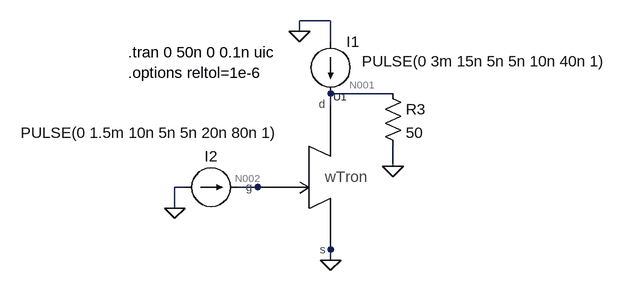
[diagram p0: schematic wtron_test.asc]
wtron_test.asc, the LTspice schematic file:
Version 4
SHEET 1 880 680
WIRE 288 112 240 112
WIRE 240 128 240 112
WIRE 288 144 288 112
WIRE 384 224 288 224
WIRE 288 240 288 224
WIRE 384 336 384 304
WIRE 64 368 48 368
WIRE 176 368 144 368
WIRE 192 368 176 368
WIRE 48 400 48 368
WIRE 288 464 288 448
WIRE 288 480 288 464
FLAG 240 128 0
FLAG 384 336 0
FLAG 48 400 0
FLAG 288 480 0
SYMBOL wtron 288 352 R0
SYMATTR InstName U1
SYMATTR Value2 ""
SYMATTR Value ""
SYMATTR SpiceLine ""
SYMBOL res 368 208 R0
SYMATTR InstName R3
SYMATTR Value 50
SYMBOL current 288 144 R0
WINDOW 123 0 0 Left 0
WINDOW 39 0 0 Left 0
WINDOW 3 48 30 Left 2
SYMATTR Value PULSE(0 3m 15n 5n 5n 10n 40n 1)
SYMATTR InstName I1
SYMBOL current 64 368 R270
WINDOW 0 32 40 VTop 2
WINDOW 3 99 -54 VBottom 2
WINDOW 123 0 0 Left 0
WINDOW 39 0 0 Left 0
SYMATTR InstName I2
SYMATTR Value PULSE(0 1.5m 10n 5n 5n 20n 80n 1)
TEXT -24 160 Left 2 !.tran 0 50n 0 0.1n uic
TEXT -24 192 Left 2 !.options reltol=1e-6

The netlist it stands for:
* wtron_test.asc
XU1 N002 N001 0 wtron  ; pins g d s
R3 N001 0 50
I1 0 N001 PULSE(0 3m 15n 5n 5n 10n 40n 1)
I2 0 N002 PULSE(0 1.5m 10n 5n 5n 20n 80n 1)
.tran 0 50n 0 0.1n uic
.options reltol=1e-6
.lib wtron.lib
.backanno
.end

* Results of the author's LTspice run, read from the files saved beside the schematic
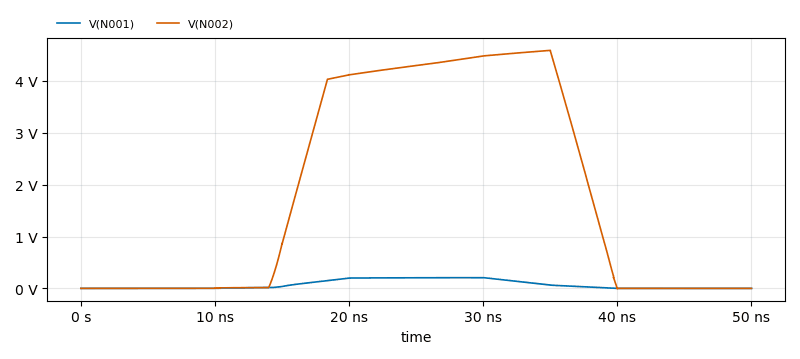
[diagram p1: Transient Analysis of wtron_test.asc, plotted from the saved traces]
* Transient Analysis, 1 run:
*   V(N001): min 0 V, max 207.8 mV, average 71.15 mV, rms 111.1 mV, last 680.9 nV
*   V(N002): min -7.799 mV, max 4.59 V, average 1.85 V, rms 2.734 V, last 0 V